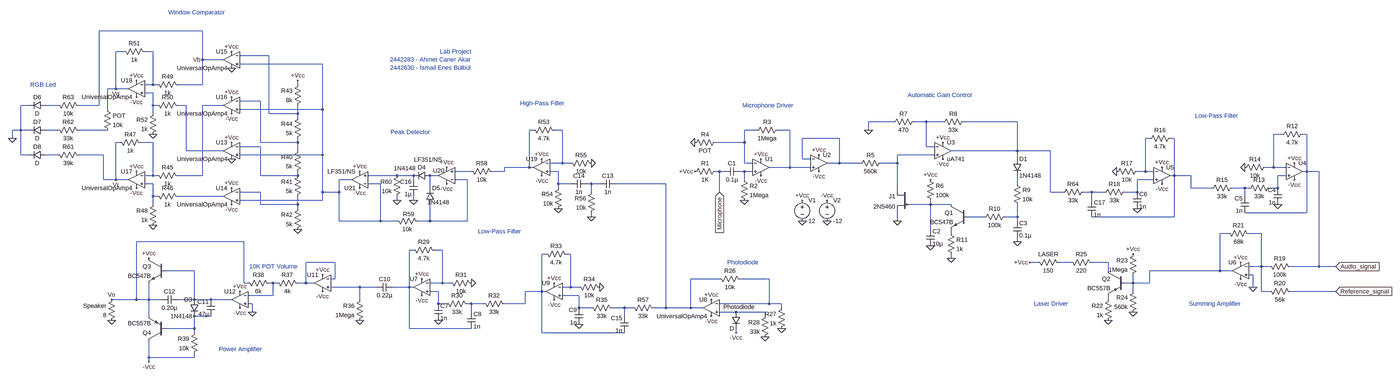
[diagram p0: schematic all_circuit.asc, whole sheet]
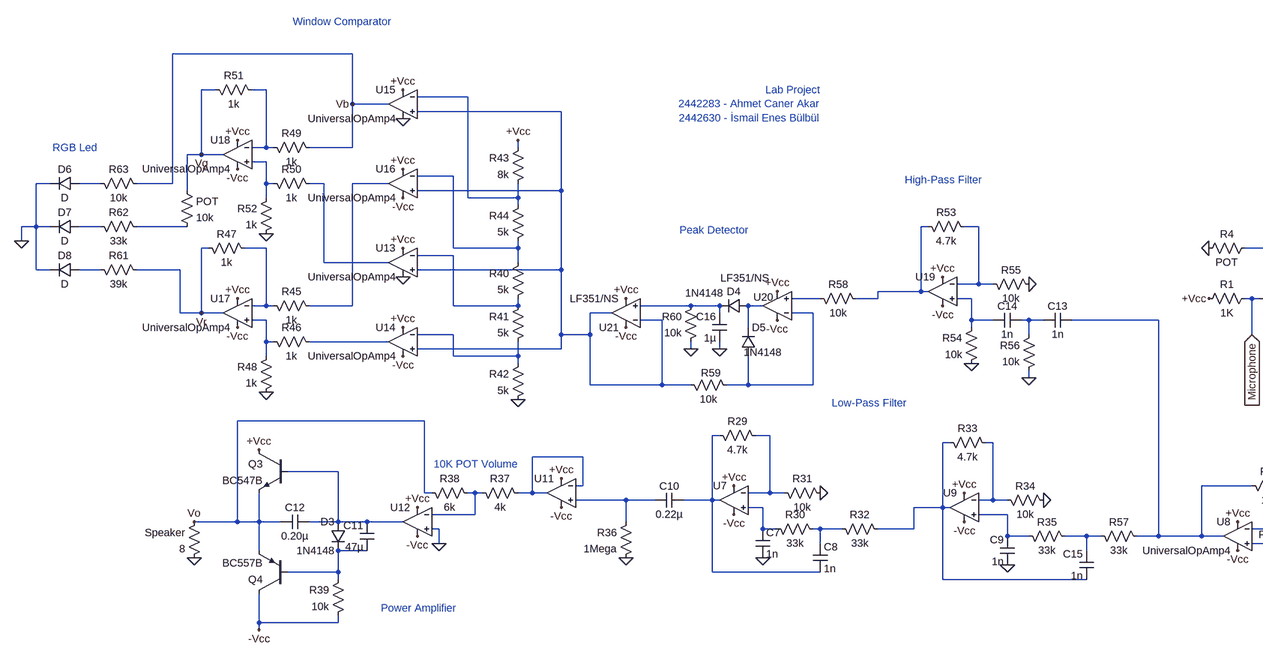
[diagram p1: schematic all_circuit.asc, part, row 1 of 1, column 1 of 2]
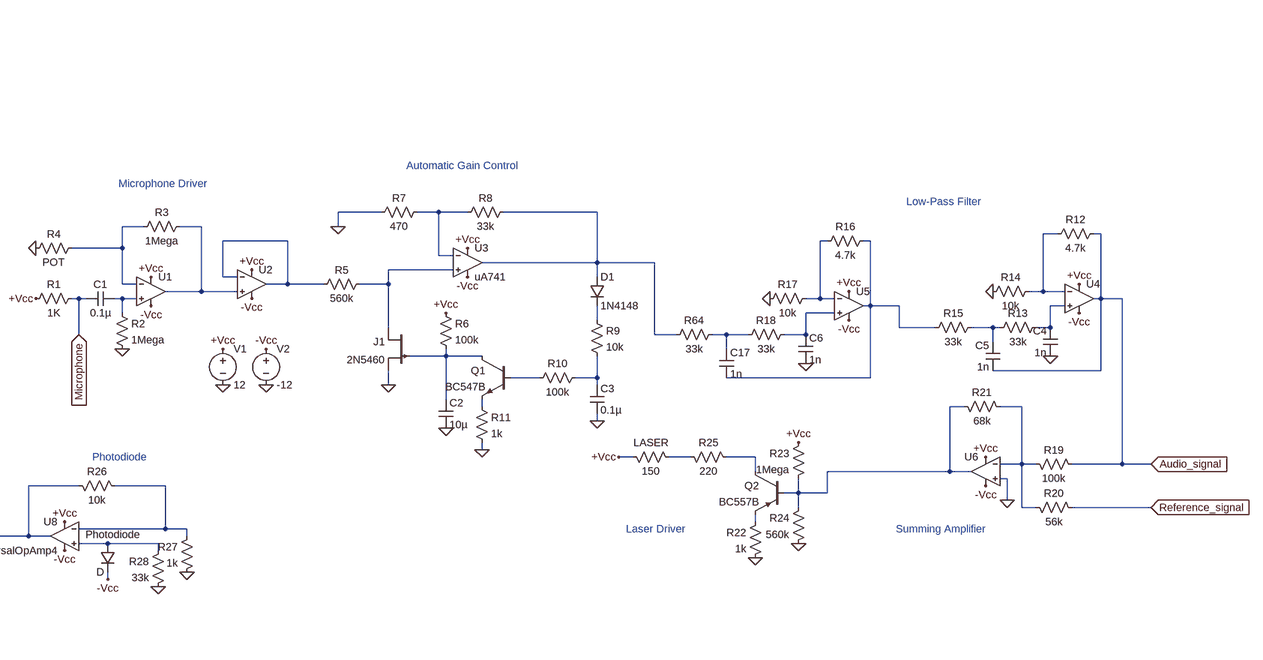
[diagram p2: schematic all_circuit.asc, part, row 1 of 1, column 2 of 2]
all_circuit.asc, the LTspice schematic file:
Version 4
SHEET 1 2676 912
WIRE -2048 -464 -2448 -464
WIRE -2352 -384 -2384 -384
WIRE -2240 -384 -2272 -384
WIRE -1792 -368 -1904 -368
WIRE -2048 -352 -2048 -464
WIRE -1968 -352 -2048 -352
WIRE -1584 -336 -1904 -336
WIRE -2240 -256 -2240 -384
WIRE -2240 -256 -2272 -256
WIRE -2224 -256 -2240 -256
WIRE -2048 -256 -2048 -352
WIRE -2048 -256 -2144 -256
WIRE -1680 -256 -1680 -272
WIRE -2384 -240 -2384 -384
WIRE -2384 -240 -2416 -240
WIRE -2336 -240 -2384 -240
WIRE -2240 -224 -2272 -224
WIRE -1824 -192 -1904 -192
WIRE -2720 -176 -2752 -176
WIRE -2608 -176 -2656 -176
WIRE -2448 -176 -2448 -464
WIRE -2448 -176 -2528 -176
WIRE -2240 -176 -2240 -224
WIRE -2224 -176 -2240 -176
WIRE -2112 -176 -2144 -176
WIRE -1968 -176 -2048 -176
WIRE -2416 -160 -2416 -240
WIRE -1584 -160 -1584 -336
WIRE -1584 -160 -1904 -160
WIRE -2240 -144 -2240 -176
WIRE -1792 -144 -1792 -368
WIRE -1680 -144 -1680 -176
WIRE -1680 -144 -1792 -144
WIRE -1680 -128 -1680 -144
WIRE 624 -112 528 -112
WIRE 752 -112 704 -112
WIRE 816 -112 752 -112
WIRE 1104 -112 896 -112
WIRE -2752 -80 -2752 -176
WIRE -2752 -80 -2784 -80
WIRE -2720 -80 -2752 -80
WIRE -2608 -80 -2656 -80
WIRE -2416 -80 -2528 -80
WIRE -768 -80 -784 -80
WIRE -656 -80 -688 -80
WIRE 96 -80 48 -80
WIRE 224 -80 176 -80
WIRE 528 -80 528 -112
WIRE 2128 -64 2096 -64
WIRE 2224 -64 2208 -64
WIRE -2784 -48 -2784 -80
WIRE 416 -48 272 -48
WIRE 1616 -48 1600 -48
WIRE 1712 -48 1696 -48
WIRE -2368 -32 -2384 -32
WIRE -2240 -32 -2288 -32
WIRE -1824 -32 -1824 -192
WIRE -1680 -32 -1680 -48
WIRE -1680 -32 -1824 -32
WIRE 48 -32 48 -80
WIRE 48 -32 -64 -32
WIRE -1824 -16 -1904 -16
WIRE 752 -16 752 -112
WIRE 784 -16 752 -16
WIRE -2112 0 -2112 -176
WIRE -1968 0 -2112 0
WIRE -1680 0 -1680 -32
WIRE 1104 0 1104 -112
WIRE 1104 0 848 0
WIRE 1232 0 1104 0
WIRE -2752 16 -2752 -80
WIRE -2720 16 -2752 16
WIRE -2608 16 -2656 16
WIRE -2432 16 -2528 16
WIRE -1584 16 -1584 -160
WIRE -1584 16 -1904 16
WIRE 784 16 640 16
WIRE 272 32 272 -48
WIRE 304 32 272 32
WIRE 1104 32 1104 0
WIRE -656 48 -656 -80
WIRE -656 48 -704 48
WIRE -624 48 -656 48
WIRE 48 48 48 -32
WIRE 80 48 48 48
WIRE 416 48 416 -48
WIRE 416 48 368 48
WIRE 496 48 416 48
WIRE 640 48 640 16
WIRE 640 48 576 48
WIRE -784 64 -784 -80
WIRE -784 64 -880 64
WIRE -768 64 -784 64
WIRE 224 64 224 -80
WIRE 224 64 144 64
WIRE 304 64 224 64
WIRE 2096 64 2096 -64
WIRE 2096 64 2064 64
WIRE 2144 64 2096 64
WIRE -1008 80 -1072 80
WIRE -880 80 -880 64
WIRE -880 80 -928 80
WIRE -672 80 -704 80
WIRE -48 80 -64 80
WIRE -32 80 -48 80
WIRE 48 80 32 80
WIRE 80 80 48 80
WIRE 1600 80 1600 -48
WIRE 1600 80 1568 80
WIRE 1632 80 1600 80
WIRE 2224 80 2224 -64
WIRE 2224 80 2208 80
WIRE 2272 80 2224 80
WIRE -2240 96 -2240 -32
WIRE -2240 96 -2272 96
WIRE -2224 96 -2240 96
WIRE -2048 96 -2048 -176
WIRE -2048 96 -2144 96
WIRE -1824 96 -1824 -16
WIRE -1680 96 -1680 80
WIRE -1680 96 -1824 96
WIRE -1296 96 -1408 96
WIRE -1232 96 -1296 96
WIRE -1136 96 -1168 96
WIRE 1712 96 1712 -48
WIRE 1712 96 1696 96
WIRE 1776 96 1712 96
WIRE 2144 96 2112 96
WIRE -2432 112 -2432 16
WIRE -2384 112 -2384 -32
WIRE -2384 112 -2432 112
WIRE -2336 112 -2384 112
WIRE -1472 112 -1520 112
WIRE -1232 112 -1232 96
WIRE -1024 112 -1072 112
WIRE 48 112 48 80
WIRE 1632 112 1568 112
WIRE -2240 128 -2272 128
WIRE -1360 128 -1408 128
WIRE -672 128 -672 80
WIRE -624 128 -672 128
WIRE -544 128 -560 128
WIRE -512 128 -544 128
WIRE -256 128 -448 128
WIRE 1104 128 1104 96
WIRE -1168 144 -1168 96
WIRE -672 144 -672 128
WIRE 640 144 640 48
WIRE 1776 144 1776 96
WIRE 1856 144 1776 144
WIRE 1984 144 1936 144
WIRE 2000 144 1984 144
WIRE 2112 144 2112 96
WIRE 2112 144 2080 144
WIRE -1824 160 -1904 160
WIRE -1584 160 -1584 16
WIRE -1520 160 -1520 112
WIRE -1520 160 -1584 160
WIRE -544 160 -544 128
WIRE -48 160 -48 80
WIRE 1232 160 1232 0
WIRE 1280 160 1232 160
WIRE 1392 160 1360 160
WIRE 1440 160 1392 160
WIRE 1568 160 1568 112
WIRE 1568 160 1520 160
WIRE -2240 176 -2240 128
WIRE -2224 176 -2240 176
WIRE -1968 176 -2144 176
WIRE 1984 176 1984 144
WIRE -1584 192 -1584 160
WIRE -1584 192 -1904 192
WIRE -1296 192 -1296 176
WIRE -1232 192 -1232 176
WIRE 1392 192 1392 160
WIRE -2240 208 -2240 176
WIRE -1824 208 -1824 160
WIRE -1680 208 -1680 176
WIRE -1680 208 -1824 208
WIRE 768 208 768 192
WIRE 768 208 688 208
WIRE 848 208 768 208
WIRE -1680 224 -1680 208
WIRE 2224 240 2224 80
WIRE 2224 240 1984 240
WIRE -544 256 -544 240
WIRE 976 256 912 256
WIRE 1104 256 1104 208
WIRE 1104 256 1056 256
WIRE 1712 256 1712 96
WIRE 1712 256 1392 256
WIRE -1520 272 -1520 160
WIRE -1360 272 -1360 128
WIRE -1360 272 -1520 272
WIRE -1296 272 -1360 272
WIRE -1168 272 -1168 208
WIRE -1168 272 -1216 272
WIRE -1024 272 -1024 112
WIRE -1024 272 -1168 272
WIRE 640 272 640 240
WIRE 1104 272 1104 256
WIRE 768 304 768 208
WIRE 848 320 848 304
WIRE 1920 320 1888 320
WIRE 2048 320 2000 320
WIRE -1888 352 -2304 352
WIRE 1104 352 1104 336
WIRE -1232 384 -1248 384
WIRE -1120 384 -1152 384
WIRE -720 400 -736 400
WIRE -624 400 -640 400
WIRE 848 416 848 400
WIRE -1536 432 -1648 432
WIRE 1184 432 1152 432
WIRE 1312 432 1264 432
WIRE 1456 432 1392 432
WIRE 2048 448 2048 320
WIRE 2048 448 2000 448
WIRE 2080 448 2048 448
WIRE 2272 448 2272 80
WIRE 2272 448 2160 448
WIRE 2336 448 2272 448
WIRE -2080 464 -2192 464
WIRE 1456 464 1456 432
WIRE 1888 464 1888 320
WIRE 1888 464 1616 464
WIRE 1936 464 1888 464
WIRE 2016 480 2000 480
WIRE -1536 496 -1536 432
WIRE -1536 496 -1552 496
WIRE -48 496 -160 496
WIRE 144 496 32 496
WIRE -1888 512 -1888 352
WIRE -1872 512 -1888 512
WIRE -1776 512 -1792 512
WIRE -1760 512 -1776 512
WIRE -1648 512 -1648 432
WIRE -1648 512 -1680 512
WIRE -1616 512 -1648 512
WIRE -1120 512 -1120 384
WIRE -1120 512 -1168 512
WIRE -1088 512 -1120 512
WIRE 1552 512 1552 480
WIRE 1552 512 1520 512
WIRE 1616 512 1616 464
WIRE 1616 512 1552 512
WIRE -1440 528 -1552 528
WIRE -1376 528 -1440 528
WIRE -1248 528 -1248 384
WIRE -1248 528 -1312 528
WIRE -1232 528 -1248 528
WIRE -624 528 -624 400
WIRE -624 528 -656 528
WIRE -592 528 -624 528
WIRE 2016 528 2016 480
WIRE -1136 544 -1168 544
WIRE -736 544 -736 400
WIRE -736 544 -800 544
WIRE -720 544 -736 544
WIRE 1552 544 1552 512
WIRE 2048 544 2048 448
WIRE 2080 544 2048 544
WIRE 2336 544 2160 544
WIRE -1776 560 -1776 512
WIRE -1776 560 -1872 560
WIRE -592 560 -656 560
WIRE -2304 576 -2304 352
WIRE -2304 576 -2400 576
WIRE -2256 576 -2256 512
WIRE -2256 576 -2304 576
WIRE -2208 576 -2256 576
WIRE -2080 576 -2080 464
WIRE -2080 576 -2144 576
WIRE -2016 576 -2080 576
WIRE -1936 576 -2016 576
WIRE -1440 576 -1440 528
WIRE 1456 576 1456 560
WIRE -1856 592 -1872 592
WIRE -1136 592 -1136 544
WIRE -1104 592 -1136 592
WIRE -1008 592 -1024 592
WIRE -960 592 -1008 592
WIRE -800 592 -800 544
WIRE -800 592 -880 592
WIRE 144 592 144 496
WIRE 144 592 -48 592
WIRE 192 592 144 592
WIRE -592 608 -592 560
WIRE -544 608 -592 608
WIRE -416 608 -464 608
WIRE -384 608 -416 608
WIRE -256 608 -256 128
WIRE -256 608 -304 608
WIRE -160 608 -160 496
WIRE -160 608 -256 608
WIRE -112 608 -160 608
WIRE 192 608 192 592
WIRE -1856 624 -1856 592
WIRE -1008 624 -1008 592
WIRE 16 624 -48 624
WIRE 128 624 16 624
WIRE -2256 640 -2256 576
WIRE -2016 640 -2080 640
WIRE -416 640 -416 608
WIRE 128 640 128 624
WIRE -2080 688 -2080 640
WIRE -2080 688 -2192 688
WIRE -1248 688 -1248 528
WIRE -1008 688 -1248 688
WIRE -2080 704 -2080 688
WIRE -736 704 -736 544
WIRE -416 704 -736 704
WIRE 16 704 16 688
WIRE -2256 800 -2256 736
WIRE -2080 800 -2080 784
WIRE -2080 800 -2256 800
WIRE -2256 816 -2256 800
FLAG 48 192 0
FLAG 272 272 0
FLAG 368 272 0
FLAG 272 192 +Vcc
FLAG 368 192 -Vcc
FLAG -144 -32 0
FLAG -48 160 Microphone
IOPIN -48 160 In
FLAG 640 272 0
FLAG 848 416 0
FLAG 528 -80 0
FLAG 816 -32 +Vcc
FLAG 816 32 -Vcc
FLAG 768 112 +Vcc
FLAG 768 368 0
FLAG 1104 352 0
FLAG 336 16 +Vcc
FLAG 112 32 +Vcc
FLAG 336 80 -Vcc
FLAG 112 96 -Vcc
FLAG 2016 528 0
FLAG 2336 448 Audio_signal
IOPIN 2336 448 In
FLAG 2336 544 Reference_signal
IOPIN 2336 544 In
FLAG 1968 432 +Vcc
FLAG 1968 496 -Vcc
FLAG -144 80 +Vcc
FLAG 1456 656 0
FLAG 1552 624 0
FLAG 1552 400 +Vcc
FLAG 1152 432 +Vcc
FLAG -80 576 +Vcc
FLAG -80 640 -Vcc
FLAG 128 720 0
FLAG 192 688 0
FLAG 16 704 -Vcc
FLAG -2400 656 0
FLAG -1584 480 +Vcc
FLAG -1904 544 +Vcc
FLAG -2256 416 +Vcc
FLAG -1584 544 -Vcc
FLAG -1904 608 -Vcc
FLAG -2256 816 -Vcc
FLAG -1440 656 0
FLAG -2400 576 Vo
FLAG -1856 624 0
FLAG -1936 -32 +Vcc
FLAG -1936 144 +Vcc
FLAG -1936 208 -Vcc
FLAG -1680 304 0
FLAG -1936 -384 +Vcc
FLAG -1936 -208 +Vcc
FLAG -1936 -144 -Vcc
FLAG -1680 -272 +Vcc
FLAG -2048 -352 Vb
FLAG -2304 80 +Vcc
FLAG -2304 144 -Vcc
FLAG -2240 288 0
FLAG -2304 -272 +Vcc
FLAG -2304 -208 -Vcc
FLAG -2240 -64 0
FLAG -2384 -240 Vg
FLAG -2384 112 Vr
FLAG -1936 32 0
FLAG -1936 -320 0
FLAG -736 32 +Vcc
FLAG -736 96 -Vcc
FLAG -672 224 0
FLAG -544 48 0
FLAG -544 256 0
FLAG -1232 192 0
FLAG -1296 192 0
FLAG -1104 128 -Vcc
FLAG -1440 144 -Vcc
FLAG -1104 64 +Vcc
FLAG -1440 80 +Vcc
FLAG -2784 -48 0
FLAG 2112 208 0
FLAG 1984 64 0
FLAG 1488 80 0
FLAG 1568 224 0
FLAG 1664 64 +Vcc
FLAG 1664 128 -Vcc
FLAG 2176 48 +Vcc
FLAG 2176 112 -Vcc
FLAG -1136 656 0
FLAG -1008 512 0
FLAG -512 528 0
FLAG -592 672 0
FLAG -688 512 +Vcc
FLAG -688 576 -Vcc
FLAG -1200 496 +Vcc
FLAG -1200 560 -Vcc
SYMBOL res -48 64 R90
WINDOW 0 0 56 VBottom 2
WINDOW 3 32 56 VTop 2
SYMATTR InstName R1
SYMATTR Value 1K
SYMBOL cap 32 64 R90
WINDOW 0 0 32 VBottom 2
WINDOW 3 32 32 VTop 2
SYMATTR InstName C1
SYMATTR Value 0.1µ
SYMBOL OpAmps\\UniversalOpAmp2 112 64 R0
SYMATTR InstName U1
SYMBOL res 32 96 R0
SYMATTR InstName R2
SYMATTR Value 1Mega
SYMBOL res 192 -96 R90
WINDOW 0 0 56 VBottom 2
WINDOW 3 32 56 VTop 2
SYMATTR InstName R3
SYMATTR Value 1Mega
SYMBOL voltage 272 176 R0
WINDOW 123 0 0 Left 0
WINDOW 39 0 0 Left 0
SYMATTR InstName V1
SYMATTR Value 12
SYMBOL voltage 368 176 R0
WINDOW 123 0 0 Left 0
WINDOW 39 0 0 Left 0
SYMATTR InstName V2
SYMATTR Value -12
SYMBOL res -48 -48 R90
WINDOW 0 0 56 VBottom 2
WINDOW 3 32 56 VTop 2
SYMATTR InstName R4
SYMATTR Value POT
SYMBOL OpAmps\\UniversalOpAmp2 336 48 R0
SYMATTR InstName U2
SYMBOL res 592 32 R90
WINDOW 0 0 56 VBottom 2
WINDOW 3 32 56 VTop 2
SYMATTR InstName R5
SYMATTR Value 560k
SYMBOL pjf 688 144 M0
SYMATTR InstName J1
SYMATTR Value 2N5460
SYMBOL res 752 96 R0
SYMATTR InstName R6
SYMATTR Value 100k
SYMBOL npn 912 208 M0
SYMATTR InstName Q1
SYMATTR Value BC547B
SYMBOL OpAmps\\uA741 816 -64 R0
SYMATTR InstName U3
SYMBOL res 720 -128 R90
WINDOW 0 0 56 VBottom 2
WINDOW 3 32 56 VTop 2
SYMATTR InstName R7
SYMATTR Value 470
SYMBOL res 912 -128 R90
WINDOW 0 0 56 VBottom 2
WINDOW 3 32 56 VTop 2
SYMATTR InstName R8
SYMATTR Value 33k
SYMBOL cap 752 304 R0
SYMATTR InstName C2
SYMATTR Value 10µ
SYMBOL diode 1088 32 R0
SYMATTR InstName D1
SYMATTR Value 1N4148
SYMBOL res 1088 112 R0
SYMATTR InstName R9
SYMATTR Value 10k
SYMBOL res 1072 240 R90
WINDOW 0 0 56 VBottom 2
WINDOW 3 32 56 VTop 2
SYMATTR InstName R10
SYMATTR Value 100k
SYMBOL cap 1088 272 R0
SYMATTR InstName C3
SYMATTR Value 0.1µ
SYMBOL res 832 304 R0
SYMATTR InstName R11
SYMATTR Value 1k
SYMBOL res 2064 432 M90
WINDOW 0 0 56 VBottom 2
WINDOW 3 32 56 VTop 2
SYMATTR InstName R19
SYMATTR Value 100k
SYMBOL res 2064 528 M90
WINDOW 0 0 56 VBottom 2
WINDOW 3 32 56 VTop 2
SYMATTR InstName R20
SYMATTR Value 56k
SYMBOL OpAmps\\UniversalOpAmp2 1968 464 M0
SYMATTR InstName U6
SYMBOL res 1904 304 M90
WINDOW 0 0 56 VBottom 2
WINDOW 3 32 56 VTop 2
SYMATTR InstName R21
SYMATTR Value 68k
SYMBOL res 1472 560 M0
SYMATTR InstName R22
SYMATTR Value 1k
SYMBOL res 1568 384 M0
SYMATTR InstName R23
SYMATTR Value 1Mega
SYMBOL res 1568 528 M0
SYMATTR InstName R24
SYMATTR Value 560k
SYMBOL res 1296 416 M90
WINDOW 0 0 56 VBottom 2
WINDOW 3 32 56 VTop 2
SYMATTR InstName R25
SYMATTR Value 220
SYMBOL res 1168 416 M90
WINDOW 0 0 56 VBottom 2
WINDOW 3 32 56 VTop 2
SYMATTR InstName LASER
SYMATTR Value 150
SYMBOL pnp 1520 464 M0
SYMATTR InstName Q2
SYMATTR Value BC557B
SYMBOL OpAmps\\UniversalOpAmp4 -80 608 M0
SYMATTR InstName U8
SYMBOL res -64 480 M90
WINDOW 0 0 56 VBottom 2
WINDOW 3 32 56 VTop 2
SYMATTR InstName R26
SYMATTR Value 10k
SYMBOL res 208 592 M0
SYMATTR InstName R27
SYMATTR Value 1k
SYMBOL res 144 624 M0
SYMATTR InstName R28
SYMATTR Value 33k
SYMBOL diode 32 624 M0
WINDOW 0 -57 -20 Left 2
SYMATTR InstName Photodiode
SYMBOL cap -1376 512 M90
WINDOW 0 0 32 VBottom 2
WINDOW 3 32 32 VTop 2
SYMATTR InstName C10
SYMATTR Value 0.22µ
SYMBOL res -1424 560 M0
SYMATTR InstName R36
SYMATTR Value 1Mega
SYMBOL OpAmps\\UniversalOpAmp2 -1584 512 M0
SYMATTR InstName U11
SYMBOL res -1776 496 M90
WINDOW 0 0 56 VBottom 2
WINDOW 3 32 56 VTop 2
SYMATTR InstName R37
SYMATTR Value 4k
SYMBOL OpAmps\\UniversalOpAmp2 -1904 576 M0
SYMATTR InstName U12
SYMBOL res -1888 496 M90
WINDOW 0 0 56 VBottom 2
WINDOW 3 32 56 VTop 2
SYMATTR InstName R38
SYMATTR Value 6k
SYMBOL cap -2000 576 M0
SYMATTR InstName C11
SYMATTR Value 47µ
SYMBOL diode -2064 576 M0
SYMATTR InstName D3
SYMATTR Value 1N4148
SYMBOL cap -2208 560 M90
WINDOW 0 0 32 VBottom 2
WINDOW 3 32 32 VTop 2
SYMATTR InstName C12
SYMATTR Value 0.20µ
SYMBOL npn -2192 416 M0
SYMATTR InstName Q3
SYMATTR Value BC547B
SYMBOL pnp -2192 736 R180
SYMATTR InstName Q4
SYMATTR Value BC557B
SYMBOL res -2064 688 M0
SYMATTR InstName R39
SYMATTR Value 10k
SYMBOL res -2384 560 M0
SYMATTR InstName Speaker
SYMATTR Value 8
SYMBOL OpAmps\\UniversalOpAmp4 -1936 0 M0
SYMATTR InstName U13
SYMBOL OpAmps\\UniversalOpAmp4 -1936 176 M0
SYMATTR InstName U14
SYMBOL res -1664 -16 M0
SYMATTR InstName R40
SYMATTR Value 5k
SYMBOL res -1664 80 M0
SYMATTR InstName R41
SYMATTR Value 5k
SYMBOL res -1664 208 M0
SYMATTR InstName R42
SYMATTR Value 5k
SYMBOL OpAmps\\UniversalOpAmp4 -1936 -352 M0
SYMATTR InstName U15
SYMBOL OpAmps\\UniversalOpAmp4 -1936 -176 M0
SYMATTR InstName U16
SYMBOL res -1664 -272 M0
SYMATTR InstName R43
SYMATTR Value 8k
SYMBOL res -1664 -144 M0
SYMATTR InstName R44
SYMATTR Value 5k
SYMBOL OpAmps\\UniversalOpAmp4 -2304 112 M0
SYMATTR InstName U17
SYMBOL res -2240 80 M90
WINDOW 0 0 56 VBottom 2
WINDOW 3 32 56 VTop 2
SYMATTR InstName R45
SYMATTR Value 1k
SYMBOL res -2240 160 M90
WINDOW 0 0 56 VBottom 2
WINDOW 3 32 56 VTop 2
SYMATTR InstName R46
SYMATTR Value 1k
SYMBOL res -2384 -48 M90
WINDOW 0 0 56 VBottom 2
WINDOW 3 32 56 VTop 2
SYMATTR InstName R47
SYMATTR Value 1k
SYMBOL res -2224 192 M0
SYMATTR InstName R48
SYMATTR Value 1k
SYMBOL OpAmps\\UniversalOpAmp4 -2304 -240 M0
SYMATTR InstName U18
SYMBOL res -2240 -272 M90
WINDOW 0 0 56 VBottom 2
WINDOW 3 32 56 VTop 2
SYMATTR InstName R49
SYMATTR Value 1k
SYMBOL res -2240 -192 M90
WINDOW 0 0 56 VBottom 2
WINDOW 3 32 56 VTop 2
SYMATTR InstName R50
SYMATTR Value 1k
SYMBOL res -2368 -400 M90
WINDOW 0 0 56 VBottom 2
WINDOW 3 32 56 VTop 2
SYMATTR InstName R51
SYMATTR Value 1k
SYMBOL res -2224 -160 M0
SYMATTR InstName R52
SYMATTR Value 1k
SYMBOL OpAmps\\UniversalOpAmp -736 64 M0
SYMATTR InstName U19
SYMBOL res -784 -96 M90
WINDOW 0 0 56 VBottom 2
WINDOW 3 32 56 VTop 2
SYMATTR InstName R53
SYMATTR Value 4.7k
SYMBOL res -656 128 M0
SYMATTR InstName R54
SYMATTR Value 10k
SYMBOL cap -448 144 M270
WINDOW 0 32 32 VTop 2
WINDOW 3 0 32 VBottom 2
SYMATTR InstName C13
SYMATTR Value 1n
SYMBOL res -640 32 M90
WINDOW 0 0 56 VBottom 2
WINDOW 3 32 56 VTop 2
SYMATTR InstName R55
SYMATTR Value 10k
SYMBOL res -528 144 M0
SYMATTR InstName R56
SYMATTR Value 10k
SYMBOL cap -560 144 M270
WINDOW 0 32 32 VTop 2
WINDOW 3 0 32 VBottom 2
SYMATTR InstName C14
SYMATTR Value 1n
SYMBOL diode -1168 112 M270
WINDOW 0 32 32 VTop 2
WINDOW 3 60 98 VBottom 2
SYMATTR InstName D4
SYMATTR Value 1N4148
SYMBOL cap -1216 112 M0
SYMATTR InstName C16
SYMATTR Value 1µ
SYMBOL uA741 -1104 160 R180
WINDOW 0 8 83 Left 2
WINDOW 3 17 126 Left 2
SYMATTR InstName U20
SYMATTR Value LF351/NS
SYMBOL uA741 -1440 176 R180
SYMATTR InstName U21
SYMATTR Value LF351/NS
SYMBOL res -1024 64 M90
WINDOW 0 0 56 VBottom 2
WINDOW 3 32 56 VTop 2
SYMATTR InstName R58
SYMATTR Value 10k
SYMBOL diode -1184 208 M180
WINDOW 0 24 64 Left 2
WINDOW 3 6 9 Left 2
SYMATTR InstName D5
SYMATTR Value 1N4148
SYMBOL res -1312 256 M90
WINDOW 0 5 61 VBottom 2
WINDOW 3 32 56 VTop 2
SYMATTR InstName R59
SYMATTR Value 10k
SYMBOL res -1280 80 M0
SYMATTR InstName R60
SYMATTR Value 10k
SYMBOL res -2624 0 M90
WINDOW 0 0 56 VBottom 2
WINDOW 3 32 56 VTop 2
SYMATTR InstName R61
SYMATTR Value 39k
SYMBOL res -2624 -96 M90
WINDOW 0 0 56 VBottom 2
WINDOW 3 32 56 VTop 2
SYMATTR InstName R62
SYMATTR Value 33k
SYMBOL res -2624 -192 M90
WINDOW 0 0 56 VBottom 2
WINDOW 3 32 56 VTop 2
SYMATTR InstName R63
SYMATTR Value 10k
SYMBOL diode -2656 -160 M270
WINDOW 0 32 32 VTop 2
WINDOW 3 0 32 VBottom 2
SYMATTR InstName D6
SYMBOL diode -2656 -64 M270
WINDOW 0 32 32 VTop 2
WINDOW 3 0 32 VBottom 2
SYMATTR InstName D7
SYMBOL diode -2656 32 M270
WINDOW 0 32 32 VTop 2
WINDOW 3 0 32 VBottom 2
SYMATTR InstName D8
SYMBOL res -2432 -176 R0
SYMATTR InstName POT
SYMATTR Value 10k
SYMBOL OpAmps\\UniversalOpAmp 2176 80 R0
SYMATTR InstName U4
SYMBOL res 2224 -80 R90
WINDOW 0 0 56 VBottom 2
WINDOW 3 32 56 VTop 2
SYMATTR InstName R12
SYMATTR Value 4.7k
SYMBOL res 1984 160 R270
WINDOW 0 32 56 VTop 2
WINDOW 3 0 56 VBottom 2
SYMATTR InstName R13
SYMATTR Value 33k
SYMBOL cap 2128 208 R180
WINDOW 0 24 56 Left 2
WINDOW 3 24 8 Left 2
SYMATTR InstName C4
SYMATTR Value 1n
SYMBOL res 2080 48 R90
WINDOW 0 0 56 VBottom 2
WINDOW 3 32 56 VTop 2
SYMATTR InstName R14
SYMATTR Value 10k
SYMBOL res 1840 160 R270
WINDOW 0 32 56 VTop 2
WINDOW 3 0 56 VBottom 2
SYMATTR InstName R15
SYMATTR Value 33k
SYMBOL cap 2000 240 R180
WINDOW 0 24 56 Left 2
WINDOW 3 24 8 Left 2
SYMATTR InstName C5
SYMATTR Value 1n
SYMBOL OpAmps\\UniversalOpAmp 1664 96 R0
SYMATTR InstName U5
SYMBOL res 1712 -64 R90
WINDOW 0 0 56 VBottom 2
WINDOW 3 32 56 VTop 2
SYMATTR InstName R16
SYMATTR Value 4.7k
SYMBOL res 1584 64 R90
WINDOW 0 0 56 VBottom 2
WINDOW 3 32 56 VTop 2
SYMATTR InstName R17
SYMATTR Value 10k
SYMBOL res 1536 144 R90
WINDOW 0 0 56 VBottom 2
WINDOW 3 32 56 VTop 2
SYMATTR InstName R18
SYMATTR Value 33k
SYMBOL cap 1552 160 R0
SYMATTR InstName C6
SYMATTR Value 1n
SYMBOL res 1376 144 R90
WINDOW 0 0 56 VBottom 2
WINDOW 3 32 56 VTop 2
SYMATTR InstName R64
SYMATTR Value 33k
SYMBOL cap 1376 192 R0
SYMATTR InstName C17
SYMATTR Value 1n
SYMBOL OpAmps\\UniversalOpAmp -1200 528 M0
SYMATTR InstName U7
SYMBOL res -1248 368 M90
WINDOW 0 0 56 VBottom 2
WINDOW 3 32 56 VTop 2
SYMATTR InstName R29
SYMATTR Value 4.7k
SYMBOL res -1008 608 M270
WINDOW 0 32 56 VTop 2
WINDOW 3 0 56 VBottom 2
SYMATTR InstName R30
SYMATTR Value 33k
SYMBOL cap -1152 656 M180
WINDOW 0 24 56 Left 2
WINDOW 3 24 8 Left 2
SYMATTR InstName C7
SYMATTR Value 1n
SYMBOL res -1104 496 M90
WINDOW 0 0 56 VBottom 2
WINDOW 3 32 56 VTop 2
SYMATTR InstName R31
SYMATTR Value 10k
SYMBOL res -864 608 M270
WINDOW 0 32 56 VTop 2
WINDOW 3 0 56 VBottom 2
SYMATTR InstName R32
SYMATTR Value 33k
SYMBOL cap -1024 688 M180
WINDOW 0 24 56 Left 2
WINDOW 3 24 8 Left 2
SYMATTR InstName C8
SYMATTR Value 1n
SYMBOL OpAmps\\UniversalOpAmp -688 544 M0
SYMATTR InstName U9
SYMBOL res -736 384 M90
WINDOW 0 0 56 VBottom 2
WINDOW 3 32 56 VTop 2
SYMATTR InstName R33
SYMATTR Value 4.7k
SYMBOL res -608 512 M90
WINDOW 0 0 56 VBottom 2
WINDOW 3 32 56 VTop 2
SYMATTR InstName R34
SYMATTR Value 10k
SYMBOL res -560 592 M90
WINDOW 0 0 56 VBottom 2
WINDOW 3 32 56 VTop 2
SYMATTR InstName R35
SYMATTR Value 33k
SYMBOL cap -576 608 M0
SYMATTR InstName C9
SYMATTR Value 1n
SYMBOL res -400 592 M90
WINDOW 0 0 56 VBottom 2
WINDOW 3 32 56 VTop 2
SYMATTR InstName R57
SYMATTR Value 33k
SYMBOL cap -400 640 M0
SYMATTR InstName C15
SYMATTR Value 1n
TEXT -1008 -384 Right 2 ;Lab Project\n2442283 - Ahmet Caner Akar\n2442630 - İsmail Enes Bülbül
TEXT -1680 448 Right 2 ;10K POT Volume
TEXT 104 432 Right 2 ;Photodiode
TEXT -648 -184 Right 2 ;High-Pass Filter
TEXT -1168 -72 Right 2 ;Peak Detector
TEXT -1960 -536 Right 2 ;Window Comparator
TEXT -2616 -256 Right 2 ;RGB Led
TEXT -1816 768 Right 2 ;Power Amplifier
TEXT 40 -176 Left 2 ;Microphone Driver
TEXT 680 -216 Left 2 ;Automatic Gain Control
TEXT 1768 592 Left 2 ;Summing Amplifier
TEXT 1168 592 Left 2 ;Laser Driver
TEXT 1792 -136 Left 2 ;Low-Pass Filter
TEXT -816 312 Right 2 ;Low-Pass Filter

The netlist it stands for:
* all_circuit.asc
R1 Microphone +Vcc 1K
C1 N027 Microphone 0.1µ
XU1 N027 N015 +Vcc -Vcc N016 level2 Avol=1Meg GBW=10Meg Slew=10Meg Ilimit=25m Rail=0 Vos=0 En=0 Enk=0 In=0 Ink=0 Rin=500Meg  ; pins In+ In- V+ V- OUT
R2 N027 0 1Mega
R3 N016 N015 1Mega
V1 +Vcc 0 12
V2 -Vcc 0 -12
R4 N015 0 POT
XU2 N016 N018 +Vcc -Vcc N018 level2 Avol=1Meg GBW=10Meg Slew=10Meg Ilimit=25m Rail=0 Vos=0 En=0 Enk=0 In=0 Ink=0 Rin=500Meg  ; pins In+ In- V+ V- OUT
R5 N024 N018 560k
J1 N024 N041 0 2N5460
R6 +Vcc N041 100k
Q1 N041 N042 N044 0 BC547B
XU3 N024 N009 +Vcc -Vcc N010 uA741  ; pins In+ In- V+ V- OUT
R7 N009 0 470
R8 N010 N009 33k
C2 N041 0 10µ
D1 N010 N036 1N4148
R9 N036 N043 10k
R10 N043 N042 100k
C3 N043 0 0.1µ
R11 N044 0 1k
R19 N046 Audio_signal 100k
R20 N046 Reference_signal 56k
XU6 0 N046 +Vcc -Vcc N045 level2 Avol=1Meg GBW=10Meg Slew=10Meg Ilimit=25m Rail=0 Vos=0 En=0 Enk=0 In=0 Ink=0 Rin=500Meg  ; pins In+ In- V+ V- OUT
R21 N045 N046 68k
R22 N060 0 1k
R23 +Vcc N045 1Mega
R24 N045 0 560k
R25 N052 N053 220
R§LASER +Vcc N052 150
Q2 N053 N045 N060 0 BC557B
* U8: UniversalOpAmp4 (symbol OpAmps\UniversalOpAmp4 not available, pins judged from their places): In+=N063 In-=N055 V+=+Vcc V-=-Vcc OUT=N035
R26 N035 N055 10k
R27 N055 0 1k
R28 N063 0 33k
D§Photodiode N063 -Vcc D
C10 N057 N047 0.22µ
R36 N057 0 1Mega
XU11 N057 N051 +Vcc -Vcc N051 level2 Avol=1Meg GBW=10Meg Slew=10Meg Ilimit=25m Rail=0 Vos=0 En=0 Enk=0 In=0 Ink=0 Rin=500Meg  ; pins In+ In- V+ V- OUT
R37 N056 N051 4k
XU12 0 N056 +Vcc -Vcc N054 level2 Avol=1Meg GBW=10Meg Slew=10Meg Ilimit=25m Rail=0 Vos=0 En=0 Enk=0 In=0 Ink=0 Rin=500Meg  ; pins In+ In- V+ V- OUT
R38 Vo N056 6k
C11 N054 N064 47µ
D3 N054 N064 1N4148
C12 Vo N054 0.20µ
Q3 +Vcc N054 Vo 0 BC547B
Q4 -Vcc N064 Vo 0 BC557B
R39 N064 -Vcc 10k
R§Speaker Vo 0 8
* U13: UniversalOpAmp4 (symbol OpAmps\UniversalOpAmp4 not available, pins judged from their places): In+=N003 In-=N022 V+=+Vcc V-=0 OUT=N007
* U14: UniversalOpAmp4 (symbol OpAmps\UniversalOpAmp4 not available, pins judged from their places): In+=N003 In-=N038 V+=+Vcc V-=-Vcc OUT=N040
R40 N005 N022 5k
R41 N022 N038 5k
R42 N038 0 5k
* U15: UniversalOpAmp4 (symbol OpAmps\UniversalOpAmp4 not available, pins judged from their places): In+=N003 In-=N002 V+=+Vcc V-=0 OUT=Vb
* U16: UniversalOpAmp4 (symbol OpAmps\UniversalOpAmp4 not available, pins judged from their places): In+=N003 In-=N005 V+=+Vcc V-=-Vcc OUT=N008
R43 +Vcc N002 8k
R44 N002 N005 5k
* U17: UniversalOpAmp4 (symbol OpAmps\UniversalOpAmp4 not available, pins judged from their places): In+=N033 In-=N021 V+=+Vcc V-=-Vcc OUT=Vr
R45 N021 N008 1k
R46 N033 N040 1k
R47 Vr N021 1k
R48 N033 0 1k
* U18: UniversalOpAmp4 (symbol OpAmps\UniversalOpAmp4 not available, pins judged from their places): In+=N004 In-=N001 V+=+Vcc V-=-Vcc OUT=Vg
R49 N001 Vb 1k
R50 N004 N007 1k
R51 Vg N001 1k
R52 N004 0 1k
XU19 N026 N014 +Vcc -Vcc N013 level1 Avol=1Meg GBW=10Meg Vos=0 En=0 Enk=0 In=0 Ink=0 Rin=500Meg  ; pins In+ In- V+ V- OUT
R53 N013 N014 4.7k
R54 N026 0 10k
C13 N035 N034 1n
R55 N014 0 10k
R56 N034 0 10k
C14 N034 N026 1n
D4 N029 N028 1N4148
C16 N028 0 1µ
* U20: LF351/NS (symbol uA741 not available, pins judged from their places): In+=N025 In-=N031 V+=-Vcc V-=+Vcc OUT=N029
* U21: LF351/NS (symbol uA741 not available, pins judged from their places): In+=N028 In-=N003 V+=-Vcc V-=+Vcc OUT=N003
R58 N025 N013 10k
D5 N031 N029 1N4148
R59 N003 N031 10k
R60 N028 0 10k
R61 N023 Vr 39k
R62 N011 N012 33k
R63 N006 Vb 10k
D6 N006 0 D
D7 N011 0 D
D8 N023 0 D
R§POT Vg N012 10k
XU4 N030 N017 +Vcc -Vcc Audio_signal level1 Avol=1Meg GBW=10Meg Vos=0 En=0 Enk=0 In=0 Ink=0 Rin=500Meg  ; pins In+ In- V+ V- OUT
R12 Audio_signal N017 4.7k
R13 N037 N030 33k
C4 0 N030 1n
R14 N017 0 10k
R15 N020 N037 33k
C5 Audio_signal N037 1n
XU5 N032 N019 +Vcc -Vcc N020 level1 Avol=1Meg GBW=10Meg Vos=0 En=0 Enk=0 In=0 Ink=0 Rin=500Meg  ; pins In+ In- V+ V- OUT
R16 N020 N019 4.7k
R17 N019 0 10k
R18 N032 N039 33k
C6 N032 0 1n
R64 N039 N010 33k
C17 N039 N020 1n
XU7 N058 N048 +Vcc -Vcc N047 level1 Avol=1Meg GBW=10Meg Vos=0 En=0 Enk=0 In=0 Ink=0 Rin=500Meg  ; pins In+ In- V+ V- OUT
R29 N047 N048 4.7k
R30 N061 N058 33k
C7 0 N058 1n
R31 N048 0 10k
R32 N049 N061 33k
C8 N047 N061 1n
XU9 N059 N050 +Vcc -Vcc N049 level1 Avol=1Meg GBW=10Meg Vos=0 En=0 Enk=0 In=0 Ink=0 Rin=500Meg  ; pins In+ In- V+ V- OUT
R33 N049 N050 4.7k
R34 N050 0 10k
R35 N059 N062 33k
C9 N059 0 1n
R57 N062 N035 33k
C15 N062 N049 1n
.model D D
.lib standard.dio
.model NPN NPN
.model PNP PNP
.lib standard.bjt
.model NJF NJF
.model PJF PJF
.lib standard.jft
* Lab Project
* 2442283 - Ahmet Caner Akar
* 2442630 - İsmail Enes Bülbül
* 10K POT Volume
* Photodiode
* High-Pass Filter
* Peak Detector
* Window Comparator
* RGB Led
* Power Amplifier
* Microphone Driver
* Automatic Gain Control
* Summing Amplifier
* Laser Driver
* Low-Pass Filter
* Low-Pass Filter
.lib UniversalOpAmp2.lib
.lib UniversalOpAmp1.lib
.backanno
.end